# Altium schematic sheet sch_oled.SchDoc: X
size A4; Date: DD-MM-YYYY; CheckedBy: X; DrawnBy: Y; Revision: 0.0.0; SheetNumber: X; SheetTotal: Y; Projectnumber: OWN-000; Size: A4; Projectname: X
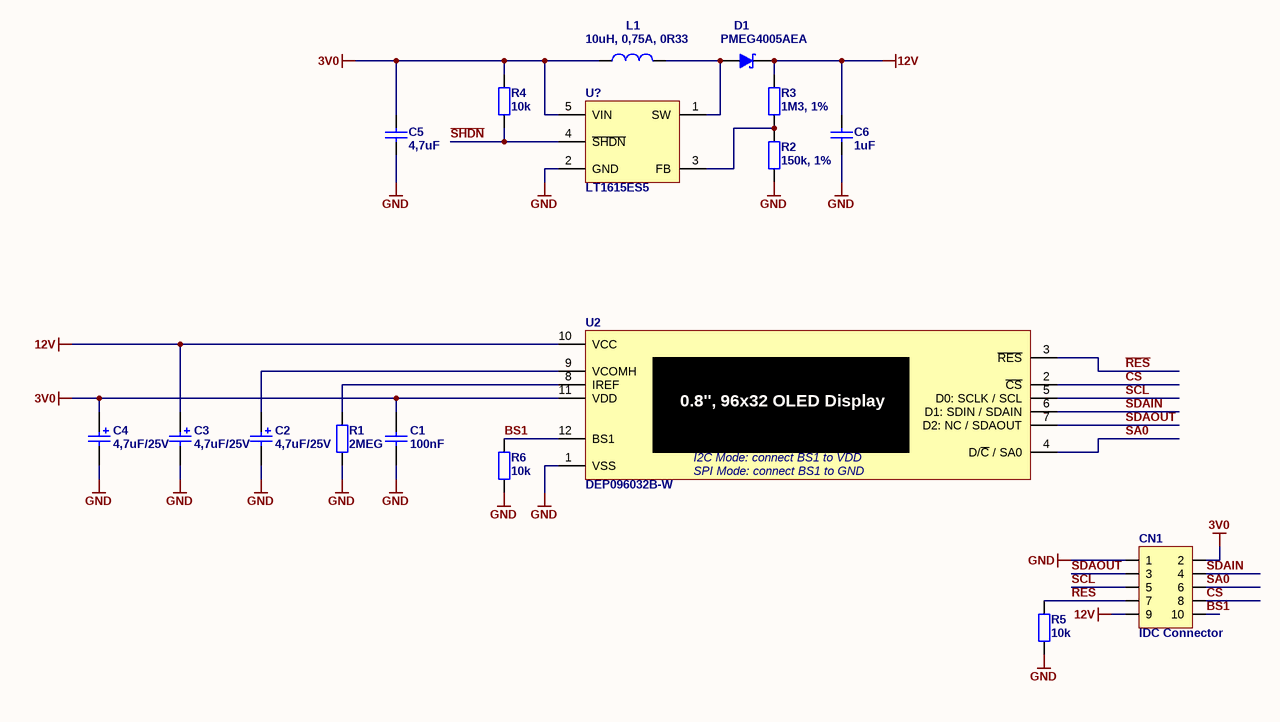
[diagram p0: sch_oled.SchDoc]

## Parts
C1  100nF  [C0603]
C2  4,7uF/25V  [SMDB]
C3  4,7uF/25V  [SMDB]
C4  4,7uF/25V  [SMDB]
C5  4,7uF  [C0603]
C6  1uF  [C0805]
CN1  IDC Connector  [IDC10_RA_1]
D1  PMEG4005AEA  [SOD323]
L1  10uH, 0,75A, 0R33  [DLJ3015]
R1  2MEG  [R0603]
R2  150k, 1%  [R0603]
R3  1M3, 1%  [R0603]
R4  10k  [R0603]
R5  10k  [R0603]
R6  10k  [R0603]
U2  DEP096032B-W  [DEP096032B-W_2]
U?  LT1615ES5  [SOT-23-5]

## Nets
3V0: C1.2 C4.1 C5.2 CN1.2 L1.1 R4.2 U2.11(VDD) U?.5(VIN)
12V: C3.1 C6.2 CN1.9 D1.2(K) R3.2 U2.10(VCC)
GND: C1.1 C2.2 C3.2 C4.2 C5.1 C6.1 CN1.1 R1.1 R2.1 R5.1 R6.1 U2.1(VSS) U?.2(GND)
BS1: CN1.10 R6.2 U2.12(BS1)
~{CS}: CN1.8 U2.2(~{CS})
~{RES}: CN1.7 R5.2 U2.3(~{RES})
~{SHDN}: R4.1 U?.4(~{SHDN})
SA0: CN1.6 U2.4(D/~{C}_/_SA0)
SCL: CN1.5 U2.5(D0:_SCLK_/_SCL)
SDAIN: CN1.4 U2.6(D1:_SDIN_/_SDAIN)
SDAOUT: CN1.3 U2.7(D2:_NC_/_SDAOUT)
NetC2_1: C2.1 U2.9(VCOMH)
NetD1_1: D1.1(A) L1.2 U?.1(SW)
NetR1_2: R1.2 U2.8(IREF)
NetR2_2: R2.2 R3.1 U?.3(FB)

## Notes on the sheet
- PROJECT NAME:
- PROJECT NO.:
- DATE:
- TITLE:
- SHEET
- of
- DRAWN BY:
- REVISION:
- FILENAME:
- A4
- (in symbol DEP096032B-W) 0.8'', 96x32 OLED Display; I2C Mode: connect BS1 to VDD; SPI Mode: connect BS1 to GND

## Library data of the parts
C1 C5 C6 = Cap: Capacitor; ComponentLink1Description: datasheet; ComponentLink2Description: supplier
  C1: Value: 100nF
  C5: Value: 4,7uF
  C6: Value: 1uF
C2-C4 = Cap Pol Tant: Polarized Tantalum Capacitor; ComponentLink1Description: datasheet; ComponentLink2Description: supplier; Value: 4,7uF/25V
CN1 = CN_5x2
D1 = PMEG4005AEA: Schottky Diode 40V/0.5A (Farnell 8738025); Current: *; Voltage: *; Supplier 1: Farnell; Supplier 2: TME; Supplier 3: Farnell; Supplier 4: Farnell; Supplier Part Number 1: 8738025; Supplier Part Number 2: PMEG4005AEA; Supplier Part Number 3: 8738025RL; Supplier Part Number 4: 2371111
L1 = DLJ3015-10: Published: 08-Mar-2006; ComponentLink1Description: datasheet; ComponentLink2Description: supplier; Supplier 1: TME; Value: 10uH, 0,75A, 0R33; Supplier Part Number 1: DLJ3015-10
R1-R6 = Res: Resistor; Published: 19-Feb-2006; ComponentLink1Description: datasheet; ComponentLink2Description: supplier
  R1: Value: 2MEG
  R2: Value: 150k, 1%
  R3: Value: 1M3, 1%
  R4-R6: Value: 10k
U2 = DEP096032B-W: DEP096032B-W OLED Display
U? = LT1615ES5: Micropower Step-Up  DC/DC Converter